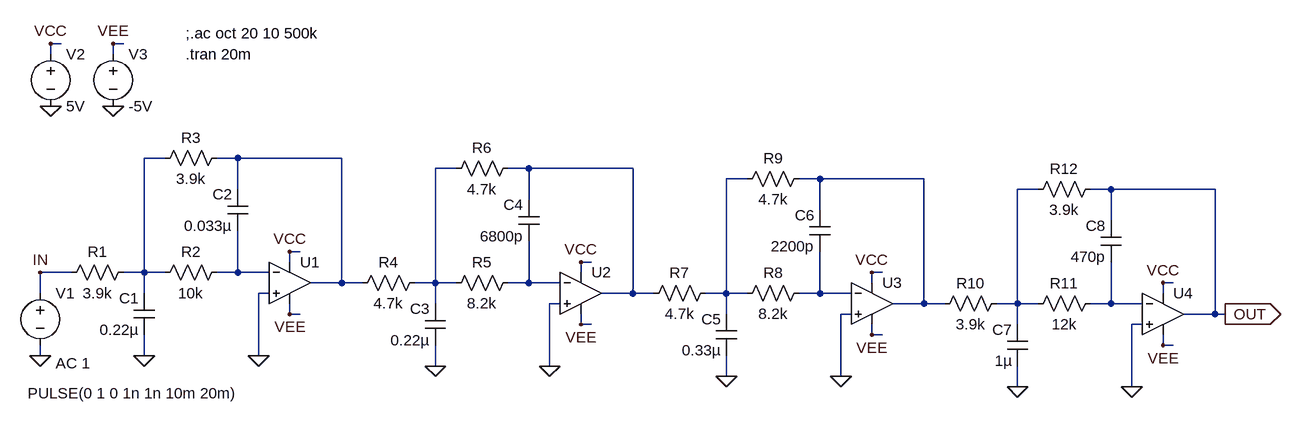
[diagram p0: schematic 8th_MFB_LPF_Chebyshev_0_5dB_1kHz_step.asc]
8th_MFB_LPF_Chebyshev_0_5dB_1kHz_step.asc, the LTspice schematic file:
Version 4
SHEET 1 1572 792
WIRE -336 -176 -352 -176
WIRE -240 -176 -256 -176
WIRE -352 -160 -352 -176
WIRE -256 -160 -256 -176
WIRE -176 0 -208 0
WIRE -64 0 -96 0
WIRE 96 0 -64 0
WIRE 272 16 240 16
WIRE 384 16 352 16
WIRE 544 16 384 16
WIRE 720 32 688 32
WIRE 832 32 800 32
WIRE 992 32 832 32
WIRE -64 48 -64 0
WIRE 1168 48 1136 48
WIRE 1280 48 1248 48
WIRE 1440 48 1280 48
WIRE 384 64 384 16
WIRE 832 80 832 32
WIRE 1280 96 1280 48
WIRE 32 144 16 144
WIRE 16 160 16 144
WIRE 480 160 464 160
WIRE -320 176 -368 176
WIRE -208 176 -208 0
WIRE -208 176 -240 176
WIRE -176 176 -208 176
WIRE -64 176 -64 112
WIRE -64 176 -96 176
WIRE -16 176 -64 176
WIRE 464 176 464 160
WIRE 928 176 912 176
WIRE 96 192 96 0
WIRE 96 192 48 192
WIRE 128 192 96 192
WIRE 240 192 240 16
WIRE 240 192 208 192
WIRE 272 192 240 192
WIRE 384 192 384 128
WIRE 384 192 352 192
WIRE 432 192 384 192
WIRE 912 192 912 176
WIRE 1376 192 1360 192
WIRE -368 208 -368 176
WIRE -208 208 -208 176
WIRE -16 208 -32 208
WIRE 544 208 544 16
WIRE 544 208 496 208
WIRE 576 208 544 208
WIRE 688 208 688 32
WIRE 688 208 656 208
WIRE 720 208 688 208
WIRE 832 208 832 144
WIRE 832 208 800 208
WIRE 880 208 832 208
WIRE 1360 208 1360 192
WIRE 240 224 240 192
WIRE 432 224 416 224
WIRE 992 224 992 32
WIRE 992 224 944 224
WIRE 1024 224 992 224
WIRE 1136 224 1136 48
WIRE 1136 224 1104 224
WIRE 1168 224 1136 224
WIRE 1280 224 1280 160
WIRE 1280 224 1248 224
WIRE 1328 224 1280 224
WIRE 16 240 16 224
WIRE 32 240 16 240
WIRE 688 240 688 208
WIRE 880 240 864 240
WIRE 1440 240 1440 48
WIRE 1440 240 1392 240
WIRE 1456 240 1440 240
WIRE 464 256 464 240
WIRE 480 256 464 256
WIRE 1136 256 1136 224
WIRE 1328 256 1312 256
WIRE 912 272 912 256
WIRE 928 272 912 272
WIRE 1360 288 1360 272
WIRE 1376 288 1360 288
WIRE -368 304 -368 288
WIRE -208 304 -208 272
WIRE -32 304 -32 208
WIRE 240 320 240 288
WIRE 416 320 416 224
WIRE 688 336 688 304
WIRE 864 336 864 240
WIRE 1136 352 1136 320
WIRE 1312 352 1312 256
FLAG 16 144 VCC
FLAG 16 240 VEE
FLAG -368 304 0
FLAG -352 -80 0
FLAG -256 -80 0
FLAG -352 -176 VCC
FLAG -256 -176 VEE
FLAG 1456 240 OUT
IOPIN 1456 240 Out
FLAG -208 304 0
FLAG -32 304 0
FLAG 464 160 VCC
FLAG 464 256 VEE
FLAG 240 320 0
FLAG 416 320 0
FLAG -368 176 IN
FLAG 912 176 VCC
FLAG 912 272 VEE
FLAG 688 336 0
FLAG 864 336 0
FLAG 1360 192 VCC
FLAG 1360 288 VEE
FLAG 1136 352 0
FLAG 1312 352 0
SYMBOL Opamps\\UniversalOpamp2 16 192 R0
SYMATTR InstName U1
SYMBOL res -224 160 R90
WINDOW 0 0 56 VBottom 2
WINDOW 3 32 56 VTop 2
SYMATTR InstName R1
SYMATTR Value 3.9k
SYMBOL res -80 160 R90
WINDOW 0 0 56 VBottom 2
WINDOW 3 32 56 VTop 2
SYMATTR InstName R2
SYMATTR Value 10k
SYMBOL cap -192 272 R180
WINDOW 0 24 56 Left 2
WINDOW 3 24 8 Left 2
SYMATTR InstName C1
SYMATTR Value 0.22µ
SYMBOL voltage -368 192 R0
WINDOW 123 24 124 Left 2
WINDOW 39 0 0 Left 2
WINDOW 3 -19 170 Left 2
SYMATTR Value2 AC 1
SYMATTR Value PULSE(0 1 0 1n 1n 10m 20m)
SYMATTR InstName V1
SYMBOL voltage -352 -176 R0
WINDOW 123 0 0 Left 2
WINDOW 39 0 0 Left 2
SYMATTR InstName V2
SYMATTR Value 5V
SYMBOL voltage -256 -176 R0
WINDOW 123 0 0 Left 2
WINDOW 39 0 0 Left 2
SYMATTR InstName V3
SYMATTR Value -5V
SYMBOL cap -48 112 R180
WINDOW 0 24 56 Left 2
WINDOW 3 24 8 Left 2
SYMATTR InstName C2
SYMATTR Value 0.033µ
SYMBOL res -80 -16 R90
WINDOW 0 0 56 VBottom 2
WINDOW 3 32 56 VTop 2
SYMATTR InstName R3
SYMATTR Value 3.9k
SYMBOL Opamps\\UniversalOpamp2 464 208 R0
SYMATTR InstName U2
SYMBOL res 224 176 R90
WINDOW 0 0 56 VBottom 2
WINDOW 3 32 56 VTop 2
SYMATTR InstName R4
SYMATTR Value 4.7k
SYMBOL res 368 176 R90
WINDOW 0 0 56 VBottom 2
WINDOW 3 32 56 VTop 2
SYMATTR InstName R5
SYMATTR Value 8.2k
SYMBOL cap 256 288 R180
WINDOW 0 24 56 Left 2
WINDOW 3 24 8 Left 2
SYMATTR InstName C3
SYMATTR Value 0.22µ
SYMBOL cap 400 128 R180
WINDOW 0 24 56 Left 2
WINDOW 3 24 8 Left 2
SYMATTR InstName C4
SYMATTR Value 6800p
SYMBOL res 368 0 R90
WINDOW 0 0 56 VBottom 2
WINDOW 3 32 56 VTop 2
SYMATTR InstName R6
SYMATTR Value 4.7k
SYMBOL Opamps\\UniversalOpamp2 912 224 R0
SYMATTR InstName U3
SYMBOL res 672 192 R90
WINDOW 0 0 56 VBottom 2
WINDOW 3 32 56 VTop 2
SYMATTR InstName R7
SYMATTR Value 4.7k
SYMBOL res 816 192 R90
WINDOW 0 0 56 VBottom 2
WINDOW 3 32 56 VTop 2
SYMATTR InstName R8
SYMATTR Value 8.2k
SYMBOL cap 704 304 R180
WINDOW 0 24 56 Left 2
WINDOW 3 24 8 Left 2
SYMATTR InstName C5
SYMATTR Value 0.33µ
SYMBOL cap 848 144 R180
WINDOW 0 24 56 Left 2
WINDOW 3 24 8 Left 2
SYMATTR InstName C6
SYMATTR Value 2200p
SYMBOL res 816 16 R90
WINDOW 0 0 56 VBottom 2
WINDOW 3 32 56 VTop 2
SYMATTR InstName R9
SYMATTR Value 4.7k
SYMBOL Opamps\\UniversalOpamp2 1360 240 R0
SYMATTR InstName U4
SYMBOL res 1120 208 R90
WINDOW 0 0 56 VBottom 2
WINDOW 3 32 56 VTop 2
SYMATTR InstName R10
SYMATTR Value 3.9k
SYMBOL res 1264 208 R90
WINDOW 0 0 56 VBottom 2
WINDOW 3 32 56 VTop 2
SYMATTR InstName R11
SYMATTR Value 12k
SYMBOL cap 1152 320 R180
WINDOW 0 24 56 Left 2
WINDOW 3 24 8 Left 2
SYMATTR InstName C7
SYMATTR Value 1µ
SYMBOL cap 1296 160 R180
WINDOW 0 24 56 Left 2
WINDOW 3 24 8 Left 2
SYMATTR InstName C8
SYMATTR Value 470p
SYMBOL res 1264 32 R90
WINDOW 0 0 56 VBottom 2
WINDOW 3 32 56 VTop 2
SYMATTR InstName R12
SYMATTR Value 3.9k
TEXT -144 -192 Left 2 !;.ac oct 20 10 500k
TEXT -144 -160 Left 2 !.tran 20m

The netlist it stands for:
* 8th_MFB_LPF_Chebyshev_0_5dB_1kHz_step.asc
XU1 0 N008 VCC VEE N002 level.2 Avol=1Meg GBW=10Meg Slew=10Meg ilimit=25m rail=0 Vos=0 phimargin=45 en=0 enk=0 in=0 ink=0 Rin=500Meg  ; pins IN+ IN- V+ V- OUT
R1 N001 IN 3.9k
R2 N008 N001 10k
C1 0 N001 0.22µ
V1 IN 0 PULSE(0 1 0 1n 1n 10m 20m) AC 1
V2 VCC 0 5V
V3 VEE 0 -5V
C2 N008 N002 0.033µ
R3 N002 N001 3.9k
XU2 0 N009 VCC VEE N004 level.2 Avol=1Meg GBW=10Meg Slew=10Meg ilimit=25m rail=0 Vos=0 phimargin=45 en=0 enk=0 in=0 ink=0 Rin=500Meg  ; pins IN+ IN- V+ V- OUT
R4 N003 N002 4.7k
R5 N009 N003 8.2k
C3 0 N003 0.22µ
C4 N009 N004 6800p
R6 N004 N003 4.7k
XU3 0 N010 VCC VEE N006 level.2 Avol=1Meg GBW=10Meg Slew=10Meg ilimit=25m rail=0 Vos=0 phimargin=45 en=0 enk=0 in=0 ink=0 Rin=500Meg  ; pins IN+ IN- V+ V- OUT
R7 N005 N004 4.7k
R8 N010 N005 8.2k
C5 0 N005 0.33µ
C6 N010 N006 2200p
R9 N006 N005 4.7k
XU4 0 N011 VCC VEE OUT level.2 Avol=1Meg GBW=10Meg Slew=10Meg ilimit=25m rail=0 Vos=0 phimargin=45 en=0 enk=0 in=0 ink=0 Rin=500Meg  ; pins IN+ IN- V+ V- OUT
R10 N007 N006 3.9k
R11 N011 N007 12k
C7 0 N007 1µ
C8 N011 OUT 470p
R12 OUT N007 3.9k
;.ac oct 20 10 500k
.tran 20m
.lib UniversalOpamps2.sub
.backanno
.end